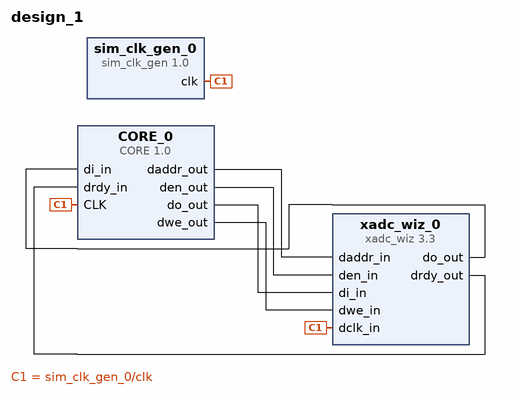
[diagram p0: block diagram of the top level]
# Vivado block design design_1, xc7z010clg400-1, Vivado 2022.1
create_bd_design design_1

create_bd_cell -type ip -vlnv xilinx.com:ip:xadc_wiz:3.3 xadc_wiz_0
set_property -dict [list \
  CONFIG.ADC_CONVERSION_RATE 1000 \
  CONFIG.ADC_OFFSET_AND_GAIN_CALIBRATION false \
  CONFIG.AVERAGE_ENABLE_VAUXP0_VAUXN0 true \
  CONFIG.AVERAGE_ENABLE_VAUXP10_VAUXN10 true \
  CONFIG.AVERAGE_ENABLE_VAUXP11_VAUXN11 true \
  CONFIG.AVERAGE_ENABLE_VAUXP12_VAUXN12 true \
  CONFIG.AVERAGE_ENABLE_VAUXP13_VAUXN13 true \
  CONFIG.AVERAGE_ENABLE_VAUXP14_VAUXN14 true \
  CONFIG.AVERAGE_ENABLE_VAUXP15_VAUXN15 true \
  CONFIG.AVERAGE_ENABLE_VAUXP1_VAUXN1 true \
  CONFIG.AVERAGE_ENABLE_VAUXP2_VAUXN2 true \
  CONFIG.AVERAGE_ENABLE_VAUXP3_VAUXN3 true \
  CONFIG.AVERAGE_ENABLE_VAUXP4_VAUXN4 true \
  CONFIG.AVERAGE_ENABLE_VAUXP5_VAUXN5 true \
  CONFIG.AVERAGE_ENABLE_VAUXP6_VAUXN6 true \
  CONFIG.AVERAGE_ENABLE_VAUXP7_VAUXN7 true \
  CONFIG.AVERAGE_ENABLE_VAUXP8_VAUXN8 true \
  CONFIG.AVERAGE_ENABLE_VAUXP9_VAUXN9 true \
  CONFIG.BIPOLAR_VAUXP0_VAUXN0 false \
  CONFIG.BIPOLAR_VAUXP10_VAUXN10 false \
  CONFIG.BIPOLAR_VAUXP11_VAUXN11 false \
  CONFIG.BIPOLAR_VAUXP12_VAUXN12 false \
  CONFIG.BIPOLAR_VAUXP13_VAUXN13 false \
  CONFIG.BIPOLAR_VAUXP14_VAUXN14 false \
  CONFIG.BIPOLAR_VAUXP15_VAUXN15 false \
  CONFIG.BIPOLAR_VAUXP1_VAUXN1 false \
  CONFIG.BIPOLAR_VAUXP2_VAUXN2 false \
  CONFIG.BIPOLAR_VAUXP3_VAUXN3 false \
  CONFIG.BIPOLAR_VAUXP4_VAUXN4 false \
  CONFIG.BIPOLAR_VAUXP5_VAUXN5 false \
  CONFIG.BIPOLAR_VAUXP6_VAUXN6 false \
  CONFIG.BIPOLAR_VAUXP7_VAUXN7 false \
  CONFIG.BIPOLAR_VAUXP8_VAUXN8 false \
  CONFIG.BIPOLAR_VAUXP9_VAUXN9 false \
  CONFIG.CHANNEL_AVERAGING 16 \
  CONFIG.CHANNEL_ENABLE_VAUXP0_VAUXN0 true \
  CONFIG.CHANNEL_ENABLE_VAUXP10_VAUXN10 true \
  CONFIG.CHANNEL_ENABLE_VAUXP11_VAUXN11 true \
  CONFIG.CHANNEL_ENABLE_VAUXP12_VAUXN12 true \
  CONFIG.CHANNEL_ENABLE_VAUXP13_VAUXN13 true \
  CONFIG.CHANNEL_ENABLE_VAUXP14_VAUXN14 true \
  CONFIG.CHANNEL_ENABLE_VAUXP15_VAUXN15 true \
  CONFIG.CHANNEL_ENABLE_VAUXP1_VAUXN1 true \
  CONFIG.CHANNEL_ENABLE_VAUXP2_VAUXN2 true \
  CONFIG.CHANNEL_ENABLE_VAUXP3_VAUXN3 true \
  CONFIG.CHANNEL_ENABLE_VAUXP4_VAUXN4 true \
  CONFIG.CHANNEL_ENABLE_VAUXP5_VAUXN5 true \
  CONFIG.CHANNEL_ENABLE_VAUXP6_VAUXN6 true \
  CONFIG.CHANNEL_ENABLE_VAUXP7_VAUXN7 true \
  CONFIG.CHANNEL_ENABLE_VAUXP8_VAUXN8 true \
  CONFIG.CHANNEL_ENABLE_VAUXP9_VAUXN9 true \
  CONFIG.CHANNEL_ENABLE_VP_VN false \
  CONFIG.DCLK_FREQUENCY 100 \
  CONFIG.ENABLE_AXI4STREAM false \
  CONFIG.ENABLE_CALIBRATION_AVERAGING false \
  CONFIG.ENABLE_RESET false \
  CONFIG.ENABLE_VCCDDRO_ALARM false \
  CONFIG.ENABLE_VCCPAUX_ALARM false \
  CONFIG.ENABLE_VCCPINT_ALARM false \
  CONFIG.EXTERNAL_MUX_CHANNEL VP_VN \
  CONFIG.INTERFACE_SELECTION ENABLE_DRP \
  CONFIG.OT_ALARM false \
  CONFIG.SENSOR_OFFSET_AND_GAIN_CALIBRATION false \
  CONFIG.SEQUENCER_MODE Continuous \
  CONFIG.SIM_FILE_NAME design \
  CONFIG.SIM_FILE_REL_PATH /mnt/d/Xilinx/Projects/Vivado/Field-Oriented-Control-on-ZYNQ/ip_repo/IP_tester/IP_tester.ip_user_files/ip/xadc_wiz_0 \
  CONFIG.SIM_FILE_SEL Relative_path \
  CONFIG.SINGLE_CHANNEL_SELECTION TEMPERATURE \
  CONFIG.USER_TEMP_ALARM false \
  CONFIG.VCCAUX_ALARM false \
  CONFIG.VCCINT_ALARM false \
  CONFIG.XADC_STARUP_SELECTION channel_sequencer \
] [get_bd_cells xadc_wiz_0]
create_bd_cell -type ip -vlnv xilinx.com:ip:sim_clk_gen:1.0 sim_clk_gen_0
set_property -dict {CONFIG.RESET_POLARITY ACTIVE_HIGH} [get_bd_cells sim_clk_gen_0]
create_bd_cell -type ip -vlnv xilinx.com:user:CORE:1.0 CORE_0
set_property -dict {CONFIG.regAddrStart 15} [get_bd_cells CORE_0]

# ---- connections ----

connect_bd_net [get_bd_pins CORE_0/daddr_out] [get_bd_pins xadc_wiz_0/daddr_in]
connect_bd_net [get_bd_pins CORE_0/den_out] [get_bd_pins xadc_wiz_0/den_in]
connect_bd_net [get_bd_pins CORE_0/do_out] [get_bd_pins xadc_wiz_0/di_in]
connect_bd_net [get_bd_pins CORE_0/dwe_out] [get_bd_pins xadc_wiz_0/dwe_in]
connect_bd_net [get_bd_pins sim_clk_gen_0/clk] [get_bd_pins xadc_wiz_0/dclk_in] [get_bd_pins CORE_0/CLK]
connect_bd_net [get_bd_pins xadc_wiz_0/do_out] [get_bd_pins CORE_0/di_in]
connect_bd_net [get_bd_pins xadc_wiz_0/drdy_out] [get_bd_pins CORE_0/drdy_in]

validate_bd_design
save_bd_design
